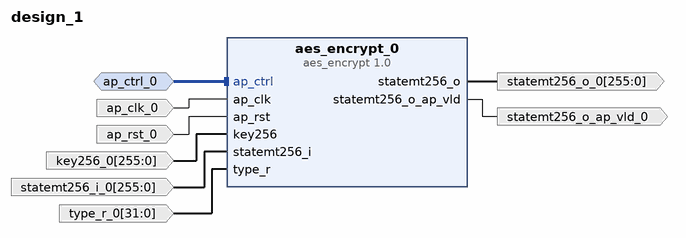
[diagram p0: block diagram of the top level]
# Vivado block design design_1, xc7z020clg484-1, Vivado 2020.2.2
create_bd_design design_1

create_bd_intf_port -mode Slave -vlnv xilinx.com:interface:acc_handshake_rtl:1.0 ap_ctrl_0
create_bd_port -dir I -type clk ap_clk_0
create_bd_port -dir I -type rst ap_rst_0
set_property -dict {CONFIG.POLARITY ACTIVE_HIGH} [get_bd_ports ap_rst_0]
create_bd_port -dir I -from 255 -to 0 -type data key256_0
create_bd_port -dir I -from 255 -to 0 -type data statemt256_i_0
create_bd_port -dir O -from 255 -to 0 -type data statemt256_o_0
create_bd_port -dir O statemt256_o_ap_vld_0
create_bd_port -dir I -from 31 -to 0 -type data type_r_0

create_bd_cell -type ip -vlnv xilinx.com:hls:aes_encrypt:1.0 aes_encrypt_0

# ---- connections ----

connect_bd_intf_net -intf_net ap_ctrl_0_1 [get_bd_intf_ports ap_ctrl_0] [get_bd_intf_pins aes_encrypt_0/ap_ctrl]
connect_bd_net -net ap_clk_0_1 [get_bd_ports ap_clk_0] [get_bd_pins aes_encrypt_0/ap_clk]
connect_bd_net -net ap_rst_0_1 [get_bd_ports ap_rst_0] [get_bd_pins aes_encrypt_0/ap_rst]
connect_bd_net -net key256_0_1 [get_bd_ports key256_0] [get_bd_pins aes_encrypt_0/key256]
connect_bd_net -net statemt256_i_0_1 [get_bd_ports statemt256_i_0] [get_bd_pins aes_encrypt_0/statemt256_i]
connect_bd_net [get_bd_pins aes_encrypt_0/statemt256_o] [get_bd_ports statemt256_o_0]
connect_bd_net [get_bd_pins aes_encrypt_0/statemt256_o_ap_vld] [get_bd_ports statemt256_o_ap_vld_0]
connect_bd_net -net type_r_0_1 [get_bd_ports type_r_0] [get_bd_pins aes_encrypt_0/type_r]

validate_bd_design
save_bd_design
